# Altium schematic sheet IMU_Board_MC_CG.SchDoc: Inertial Measurement Unit & GPS
size B; Author: Christian; CompanyName: HRT; Engineer: Christian; Organization: Husky Robotics; Address1: University of Washington; Address2: Mechanical Engineering; Address3: Seattle, WA; Address4: Australia 2086; Revision: A; SheetNumber: 1; SheetTotal: 2
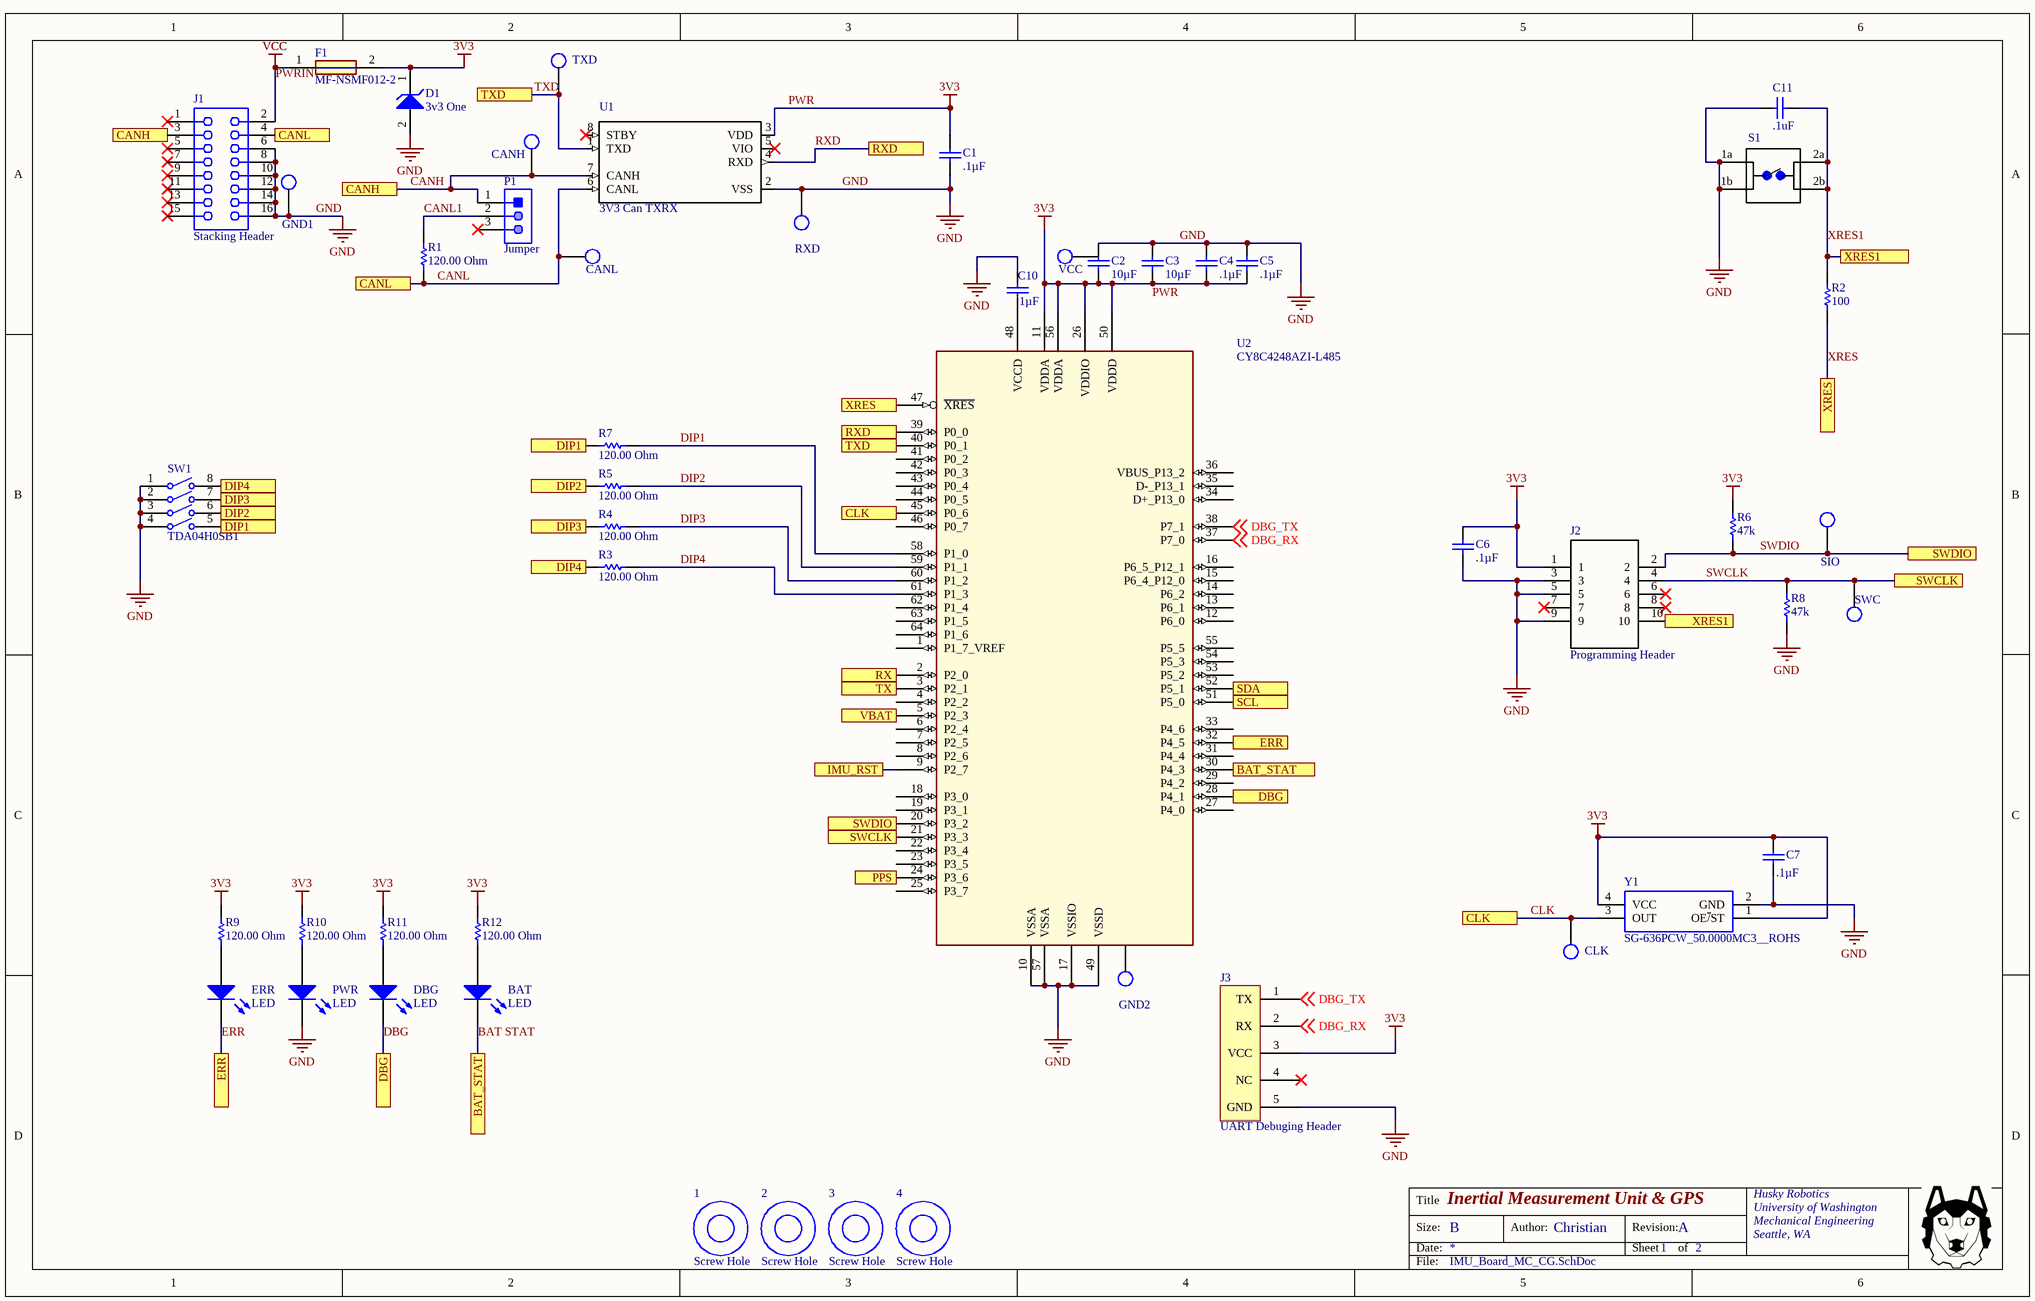
[diagram p0: IMU_Board_MC_CG.SchDoc]

## Parts
1  Screw Hole  [Screw Hole]
2  Screw Hole  [Screw Hole]
3  Screw Hole  [Screw Hole]
4  Screw Hole  [Screw Hole]
BAT  LED  [0805_A]
C1  Capacitance: .1µF  [Cap 0805]  (hidden comment: Capacitor 0805)
C2  Capacitance: 10µF  [Cap 0805]  (hidden comment: Capacitor 0805)
C3  Capacitance: 10µF  [Cap 0805]  (hidden comment: Capacitor 0805)
C4  Capacitance: .1µF  [Cap 0805]  (hidden comment: Capacitor 0805)
C5  Capacitance: .1µF  [Cap 0805]  (hidden comment: Capacitor 0805)
C6  Capacitance: .1µF  [Cap 0805]  (hidden comment: Capacitor 0805)
C7  Capacitance: .1µF  [Cap 0805]  (hidden comment: Capacitor 0805)
C10  Capacitance: 1µF  [Cap 0805]  (hidden comment: Capacitor 0805)
C11  .1uF  [CAPC0805(2012)130_N]
CANH  Test Point  [Test Point Through-hole]  (value not drawn)
CANL  Test Point  [Test Point Through-hole]  (value not drawn)
CLK  Test Point  [Test Point Through-hole]  (value not drawn)
D1  3v3 One  [ONSC-SMB-2-403A-03_H_V]
DBG  LED  [0805_A]
ERR  LED  [0805_A]
F1  MF-NSMF012-2  [FUSC3216X110N]
GND1  Test Point  [Test Point Through-hole]  (value not drawn)
GND2  Test Point  [Test Point Through-hole]  (value not drawn)
J1  Stacking Header  [SMTC-SSQ-108-02-X-D]
J2  Programming Header  [programming3D]
J3  UART Debuging Header  [UART Debugging Header]
P1  Jumper  [MOLX-22-28-4033_V]
PWR  LED  [0805_A]
R1  value 120.00 Ohm  [RESC0805(2012)_N]  (hidden comment: 120R)
R2  value 100  [RESC0805(2012)_N]  (hidden comment: 120R)
R3  value 120.00 Ohm  [RESC0805(2012)_N]  (hidden comment: 120R)
R4  value 120.00 Ohm  [RESC0805(2012)_N]  (hidden comment: 120R)
R5  value 120.00 Ohm  [RESC0805(2012)_N]  (hidden comment: 120R)
R6  value 47k  [RESC0805(2012)_N]  (hidden comment: 120R)
R7  value 120.00 Ohm  [RESC0805(2012)_N]  (hidden comment: 120R)
R8  value 47k  [RESC0805(2012)_N]  (hidden comment: 120R)
R9  value 120.00 Ohm  [RESC0805(2012)_N]  (hidden comment: 120R)
R10  value 120.00 Ohm  [RESC0805(2012)_N]  (hidden comment: 120R)
R11  value 120.00 Ohm  [RESC0805(2012)_N]  (hidden comment: 120R)
R12  value 120.00 Ohm  [RESC0805(2012)_N]  (hidden comment: 120R)
RXD  Test Point  [Test Point Through-hole]  (value not drawn)
S1  1825910-7  [Switch 6mm 24V (NO)]  (value not drawn)
SIO  Test Point  [Test Point Through-hole]  (value not drawn)
SW1  TDA04H0SB1  [CKCP-TDA04H0SB1R_V]
SWC  Test Point  [Test Point Through-hole]  (value not drawn)
TXD  Test Point  [Test Point Through-hole]  (value not drawn)
U1  3V3 Can TXRX  [SOIC127P600X175-8N]
U2  CY8C4248AZI-L485  [TQFP50P1200X1200X160-64N]
VCC  Test Point  [Test Point Through-hole]  (value not drawn)
Y1  SG-636PCW_50.0000MC3__ROHS  [SG-636_3D]

## Ports
BAT_STAT, CANH, CANL, CLK, DBG, DIP1, DIP2, DIP3, DIP4, ERR, IMU_RST, PPS, RX, RXD, SCL, SDA, SWCLK, SWDIO, TX, TXD, VBAT, XRES, XRES1

## Nets
GND: C1.1 C2.2 C3.2 C4.2 C5.2 C6.1 C7.1 C10.2 C11.2 D1.2(A) GND1.1 J1.6 J1.8 J1.10 J1.12 J1.14 J1.16 J2.3 J2.5 J2.9 J3.5(GND) PWR.1(K) R8.1 RXD.1 S1.1a S1.1b SW1.1 SW1.2 SW1.3 SW1.4 U1.2(VSS) U2.10(VSSA) U2.17(VSSIO) U2.49(VSSD) U2.57(VSSA) Y1.2(GND)
PWR: C1.2 C2.1 C3.1 C4.1 C5.1 C6.2 C7.2 D1.1(K) F1.2 J2.1 J3.3(VCC) R6.2 R9.2 R10.2 R11.2 R12.2 U1.3(VDD) U2.11(VDDA) U2.26(VDDIO) U2.50(VDDD) U2.56(VDDA) Y1.1(OE~{/}ST) Y1.4(VCC)  [also labelled 3V3]
PWRIN: F1.1 J1.2  [also labelled VCC]
BAT STAT: BAT.1(K) U2.30(P4_3) ; port BAT_STAT
CANH: CANH.1 J1.3 P1.1 U1.7(CANH) ; port CANH
CANL: CANL.1 J1.4 R1.1 U1.6(CANL) ; port CANL
CANL1: P1.2 R1.2
CLK: CLK.1 U2.45(P0_6) Y1.3(OUT) ; port CLK
DBG: DBG.1(K) U2.28(P4_1) ; port DBG
DBG_RX: J3.2(RX) U2.37(P7_0) ; off-sheet DBG_RX
DBG_TX: J3.1(TX) U2.38(P7_1) ; off-sheet DBG_TX
DIP1: R7.2 SW1.5 ; port DIP1
DIP1: R7.1 U2.58(P1_0)  [a separate net that carries the same name]
DIP2: R5.2 SW1.6 ; port DIP2
DIP2: R5.1 U2.59(P1_1)  [a separate net that carries the same name]
DIP3: R4.2 SW1.7 ; port DIP3
DIP3: R4.1 U2.60(P1_2)  [a separate net that carries the same name]
DIP4: R3.2 SW1.8 ; port DIP4
DIP4: R3.1 U2.61(P1_3)  [a separate net that carries the same name]
ERR: ERR.1(K) U2.32(P4_5) ; port ERR
IMU_RST: U2.9(P2_7) ; port IMU_RST
PPS: U2.24(P3_6) ; port PPS
RX: U2.2(P2_0) ; port RX
RXD: U1.4(RXD) U2.39(P0_0) ; port RXD
SCL: U2.51(P5_0) ; port SCL
SDA: U2.52(P5_1) ; port SDA
SWCLK: J2.4 R8.2 SWC.1 U2.21(P3_3) ; port SWCLK
SWDIO: J2.2 R6.1 SIO.1 U2.20(P3_2) ; port SWDIO
TX: U2.3(P2_1) ; port TX
TXD: TXD.1 U1.1(TXD) U2.40(P0_1) ; port TXD
VBAT: U2.5(P2_3) ; port VBAT
XRES: R2.1 U2.47(~{XRES}) ; port XRES
XRES1: C11.1 J2.10 R2.2 S1.2a S1.2b ; port XRES1
NetBAT_2: BAT.2(A) R12.1
NetC10_1: C10.1 U2.48(VCCD)
NetDBG_2: DBG.2(A) R11.1
NetERR_2: ERR.2(A) R9.1
NetPWR_2: PWR.2(A) R10.1

Not connected (* = marked no-connect by the designer): GND2 1; J1 1* 5* 7* 9* 11* 13* 15*; J2 6* 7* 8*; J3 4(NC)*; P1 3*; U1 5(VIO)* 8(STBY)*; U2 1(P1_7_VREF) 4(P2_2) 6(P2_4) 7(P2_5) 8(P2_6) 12(P6_0) 13(P6_1) 14(P6_2) 15(P6_4_P12_0) 16(P6_5_P12_1) 18(P3_0) 19(P3_1) 22(P3_4) 23(P3_5) 25(P3_7) 27(P4_0) 29(P4_2) 31(P4_4) 33(P4_6) 34(D+_P13_0) 35(D-_P13_1) 36(VBUS_P13_2) 41(P0_2) 42(P0_3) 43(P0_4) 44(P0_5) 46(P0_7) 53(P5_2) 54(P5_3) 55(P5_5) 62(P1_4) 63(P1_5) 64(P1_6); VCC 1

## Notes on the sheet
- Title
- Size:
- Date:
- B
- Author:
- Revision:
- Sheet
- of
- File:

## Library data of the parts
1-4 = Screw Hole: Add 4 of these to your design for screw hole mounting
BAT DBG ERR PWR = LED: Standard 0805 LED; Manufacturer: Wuerth Elektronik; PartNumber: 150080SS75000; PackageReference: 0805_A; ComponentLink2URL: http://katalog.we-online.com/led/datasheet/150080SS75000.pdf; ComponentLink1URL: http://www.we-online.com; Color: Super Red; ComponentLink2Description: Datasheet; ComponentLink1Description: Manufacturer URL
C1-C7 C10 = Capacitor 0805: Standard Capacitor; Manufacturer: AVX; Tolerance (%): ±10%; Dielectric: X5R; Rated Voltage: 10V; Datasheet Version: 05/2016; Manufacturer URL: http://www.avx.com/; Package Description: 2-Pin Surface Mount Device, Body 2.01 x 1.25 mm; Mounting Technology: SurfaceMount; Case Size/Dimension: 0805; Package Reference: 0805; Datasheet URL: http://datasheets.avx.com/cx5r.pdf
C11 = CMP-1036-02603-1: CAP 390pF 200V ±5% 0805 (2012 Metric) Thickness 1.3mm SMD; Case-Metric: 2012; Case-EIA: 0805; Tolerance: Â±5%; Max Thickness: 1.3 mm; Rated Voltage: 200 V; Technology: SMT; Value: 390pF
D1 = Zener Diode 5.1V: 3 W Zener Voltage Regulator, 2-Pin SMB, Pb-Free, Tape and Reel; PartNumber: 1SMB5917BT3G; Manufacturer: On Semiconductor; VZ Typ (V): 4.7; RoHS: Pb-Free; ComponentLink1Description: Manufacturer URL; ComponentLink2URL: http://www.onsemi.com/pub_link/Collateral/1SMB5913BT3-D.PDF; Mounting Technology: Surface Mount; PackageVersion: Rev. H, 05/2011; DatasheetVersion: Rev. 8; Packing: Tape and Reel; ComponentLink2Description: Datasheet; ComponentLink3Description: Package Specification; PackageReference: SMB-2-403A-03_H; ComponentLink1URL: http://www.onsemi.com/; PackageDescription: 2-Pin Small Molded Package, J-Bend Lead, Body 4.33 x 3.625 mm; ComponentLink3URL: http://www.onsemi.com/pub_link/Collateral/1SMB5913BT3-D.PDF
F1 = MF-NSMF012-2: Fuse; Manufacturer_Name: Bourns; Datasheet Link: https://componentsearchengine.com/Datasheets/2/MF-NSMF012-2.pdf; Height: 1.1mm; Manufacturer_Part_Number: MF-NSMF012-2; Arrow Part Number: MF-NSMF012-2; Arrow Price/Stock: https://www.arrow.com/en/products/mf-nsmf012-2/bourns; Mouser Part Number: 652-MF-NSMF012-2; Mouser Price/Stock: https://www.mouser.co.uk/ProductDetail/Bourns/MF-NSMF012-2?qs=lKPmECyLdCz9%2F1W04eWwOg%3D%3D
J1 = Stacking Header: SQ Post Socket, Through-hole, Vertical, -55 to 125 degC, 2.54 mm Pitch, 16-Pin, Female, RoHS; Manufacturer: Samtec; PartNumber: SSQ-108-02-G-D; Pitch: 2.54 mm; ComponentLink2URL: http://www.samtec.com/documents/webfiles/pdf/SSQ_TH.PDF; ComponentLink3Description: Package Specification; Mounting Technology: Through-hole; RoHS: True; PackageReference: SSQ-108-02-X-D; Orientation: Vertical; ComponentLink1URL: http://www.samtec.com; DatasheetVersion: F-214; Temperature Range: -55 to 125 degC; PackageDescription: Assembly, Socket Strip .025[0.64] SQ Tail; PackageVersion: BD, 6/1987; ComponentLink2Description: Datasheet; ComponentLink1Description: Manufacturer URL; ComponentLink3URL: http://www.samtec.com/documents/webfiles/cpdf/SSQ-1XX-XX-XXX-X-XX-XXX-XX-X-MKT.pdf
P1 = CMP-1676-00001-5: Male Header, Pitch 2.54 mm, 1 x 3 Position, Height 8.38 mm, Tail Length 3.18 mm, RoHS, Bulk; Manufacturer: Molex; Rows: 1; Voltage Rating: 250 V; Current Rating: 4 A; Min Operating Temperature: 0 degC; Lead Pitch: 0.1 inch; Packaging: Bulk; Contact Finish: Gold; RoHSCompliant: true; Contact Material: Brass; PackageReference: 22-28-4033; REACH SVHC: Unknown; PackageDescription: Male Header, Pitch 2.54 mm, 1 x 3 Position, Height 8.38 mm, Tail Length 3.18 mm; ComponentLink2URL: http://www.molex.com/pdm_docs/sd/022284033_sd.pdf; Height: 8.38 mm; Mounting Technology: Through Hole; ComponentLink1Description: Manufacturer URL; Length: 7.62 mm; Mount: Through Hole; DatasheetVersion: Rev. G, 01/2012; Max Operating Temperature: 75 degC; ComponentLink2Description: Datasheet; Colour: Black; Pins: 3; Contact Plating: Gold; Package Quantity: 1; ComponentLink1URL: http://www.molex.com/
R1-R12 = Resistor 0805: Generic 0805 Resistor; Tolerance: 5 %; Case-Metric: 2012; Case-EIA: 0805; Power: 0.125 W; Technology: SMT
S1 = Switch 6mm 24V (NO): FSM4JAH=6MM TACT SWITCH, HIGH TEMP; MF: TE Connectivity; Digi-Key_Part_Number: CKN9065-ND; Value: *; ComponentLink1Description: Digi-Key_Purchase_URL; ComponentLink1URL: https://www.digikey.com/en/products/detail/c-k/TDA04H0SB1/1083755; ComponentLink2Description: Datasheet Link; ComponentLink2URL: https://www.ckswitches.com/media/1328/tda.pdf
SW1 = Dip Switch Array SMD Half-Pitch: Ultra-Miniature Surface Mount Half-Pitch DIP Switch, 25 mA, 24 V, -40 to 85 degC, 8-Pin SMD, RoHS, Tube; Contact Current Rating: 100 mA; Throw Configuration: SPST; Voltage Rating (DC): 24 V; Max Contact Resistance: 100 mohm; Max Current Rating: 25 mA; REACH SVHC: No SVHC; DatasheetVersion: 02/2016; Case\Package: DIP; Package Quantity: 70; Lead Pitch: 1.27 mm; Contact Plating: Gold; Packaging: Rail/Tube; Contact Finish: Gold; Mount: Surface Mount; Height: 2.3 mm; Contact Material: Copper; Max Operating Temperature: 85 degC; Max Voltage Rating (DC): 24 V; ComponentLink1URL: https://www.ckswitches.com/media/1328/tda.pdf; PackageDescription: 8-Pin Surface Mount Device, Body 6.21 x 6.2 mm, Pitch 1.27 mm; Radiation Hardening: No; ComponentLink1Description: Datasheet Link; Current Rating: 100 mA; RoHSCompliant: true; PackageReference: TDA04H0SB1R; Min Operating Temperature: -40 degC; Pins: 4; Mounting Technology: Surface Mount; Length: 6.21 mm; Digi-Key_Part_Number: CKN9065-ND; ComponentLink2Description: Digi-Key_Purchase_URL; ComponentLink2URL: https://www.digikey.com/en/products/detail/c-k/TDA04H0SB1/1083755
U1 = CAN Tranceiver: Microchip MCP2562-E/SN, CAN Transceiver 1MBps 1-channel IEC 61000-4-2, 8-Pin SOIC; Price: None; MF: Microchip; SnapEDA_Link: https://www.snapeda.com/parts/MCP2562-E/SN/Microchip/view-part/?ref=snap; MP: MCP2562-E/SN; Availability: Unavailable; Package: SO-8 Microchip; Value: *
U2 = PSOC MC: 64 pin psoc; Part_Number: CY8C4248AZI-L485
Y1 = Oscilator: Standard Clock Oscillators; Manufacturer_Name: Epson Timing; Manufacturer_Part_Number: SG-636PCW 50.0000MC3: ROHS; RS Part Number: *; RS Price/Stock: *; Arrow Part Number: SG-636PCW 50.0000MC3: ROHS; Arrow Price/Stock: *; Datasheet Link: http://www.mouser.com/ds/2/137/G-636PCE_en-1003252.pdf